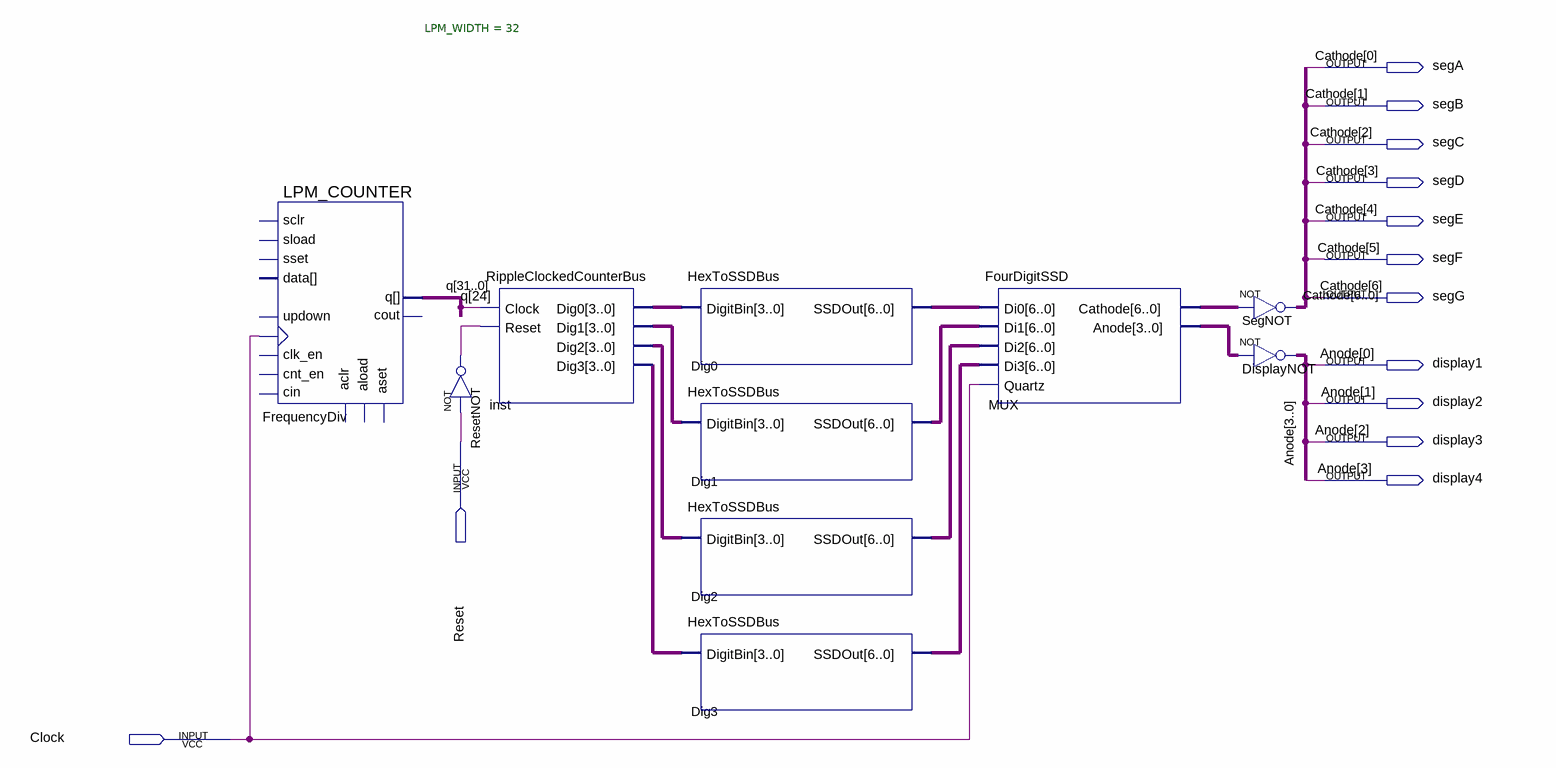
[diagram p0: schematic sheet]
// Quartus schematic FPGARipple.bdf as structural Verilog: 10 symbols, 13 pins
module FPGARipple (
  input  Reset,
  input  Clock,
  output segA,
  output segB,
  output segC,
  output segD,
  output segE,
  output segF,
  output segG,
  output display1,
  output display2,
  output display3,
  output display4
);

  wire ResetNOT_out;
  wire [3:0] inst_dig0, inst_dig1, inst_dig2, inst_dig3, MUX_anode;
  wire [6:0] Dig0_ssdout, Dig1_ssdout, Dig2_ssdout, Dig3_ssdout, MUX_cathode;
  wire [31:0] q;

  LPM_COUNTER #(.LPM_WIDTH(32)) FrequencyDiv (
    .clock(Clock), .q(q));  // open: sload, data, clk_en, aload, aclr, aset, cin, sset, updown, cnt_en, sclr, cout
  not ResetNOT (ResetNOT_out, Reset);
  RippleClockedCounterBus inst (
    .Clock(q[24]), .Reset(ResetNOT_out), .Dig0(inst_dig0), .Dig1(inst_dig1), .Dig2(inst_dig2),
    .Dig3(inst_dig3));
  HexToSSDBus Dig0 (.DigitBin(inst_dig0), .SSDOut(Dig0_ssdout));
  HexToSSDBus Dig1 (.DigitBin(inst_dig1), .SSDOut(Dig1_ssdout));
  HexToSSDBus Dig2 (.DigitBin(inst_dig2), .SSDOut(Dig2_ssdout));
  HexToSSDBus Dig3 (.DigitBin(inst_dig3), .SSDOut(Dig3_ssdout));
  FourDigitSSD MUX (
    .Di0(Dig0_ssdout), .Di1(Dig1_ssdout), .Di2(Dig2_ssdout), .Di3(Dig3_ssdout), .Quartz(Clock),
    .Cathode(MUX_cathode), .Anode(MUX_anode));
  assign {segG, segF, segE, segD, segC, segB, segA} = ~MUX_cathode;  // NOT SegNOT, 7 bits wide
  assign {display4, display3, display2, display1} = ~MUX_anode;  // NOT DisplayNOT, 4 bits wide

  // Other names for the same wires on the sheet: Anode[3:0] = {display4, display3, display2, display1};
  //   Cathode[6:0] = {segG, segF, segE, segD, segC, segB, segA}
endmodule
